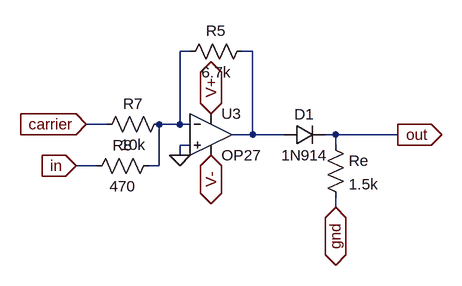
[diagram p0: schematic switching_modulator.asc]
switching_modulator.asc, the LTspice schematic file:
Version 4.1
SHEET 1 880 1512
WIRE -432 48 -448 48
WIRE -336 48 -352 48
WIRE -560 160 -592 160
WIRE -448 160 -448 48
WIRE -448 160 -480 160
WIRE -432 160 -448 160
WIRE -336 176 -336 48
WIRE -336 176 -368 176
WIRE -288 176 -336 176
WIRE -208 176 -224 176
WIRE -112 176 -208 176
WIRE -432 192 -448 192
WIRE -208 192 -208 176
WIRE -448 208 -448 192
WIRE -576 224 -608 224
WIRE -480 224 -480 160
WIRE -480 224 -496 224
WIRE -208 288 -208 272
FLAG -112 176 out
IOPIN -112 176 Out
FLAG -208 288 gnd
IOPIN -208 288 BiDir
FLAG -400 208 V-
IOPIN -400 208 BiDir
FLAG -400 144 V+
IOPIN -400 144 BiDir
FLAG -592 160 carrier
IOPIN -592 160 In
FLAG -608 224 in
IOPIN -608 224 In
FLAG -448 208 0
SYMBOL res -224 176 R0
SYMATTR InstName Re
SYMATTR Value 1.5k
SYMBOL diode -288 192 R270
WINDOW 0 32 32 VTop 2
WINDOW 3 0 32 VBottom 2
SYMATTR InstName D1
SYMATTR Value 1N914
SYMBOL OpAmps\\OP27 -400 112 R0
SYMATTR InstName U3
SYMBOL res -448 64 R270
WINDOW 0 32 56 VTop 2
WINDOW 3 0 56 VBottom 2
SYMATTR InstName R5
SYMATTR Value 6.7k
SYMBOL res -576 176 R270
WINDOW 0 32 56 VTop 2
WINDOW 3 0 56 VBottom 2
SYMATTR InstName R7
SYMATTR Value 10k
SYMBOL res -592 240 R270
WINDOW 0 32 56 VTop 2
WINDOW 3 0 56 VBottom 2
SYMATTR InstName R8
SYMATTR Value 470

The netlist it stands for:
* switching_modulator.asc
Re out gnd 1.5k
D1 N002 out 1N914
X§U3 0 N001 V+ V- N002 OP27  ; pins In+ In- V+ V- OUT
R5 N001 N002 6.7k
R7 carrier N001 10k
R8 in N001 470
.model D D
.lib standard.dio
.lib ADI.lib
.backanno
.end